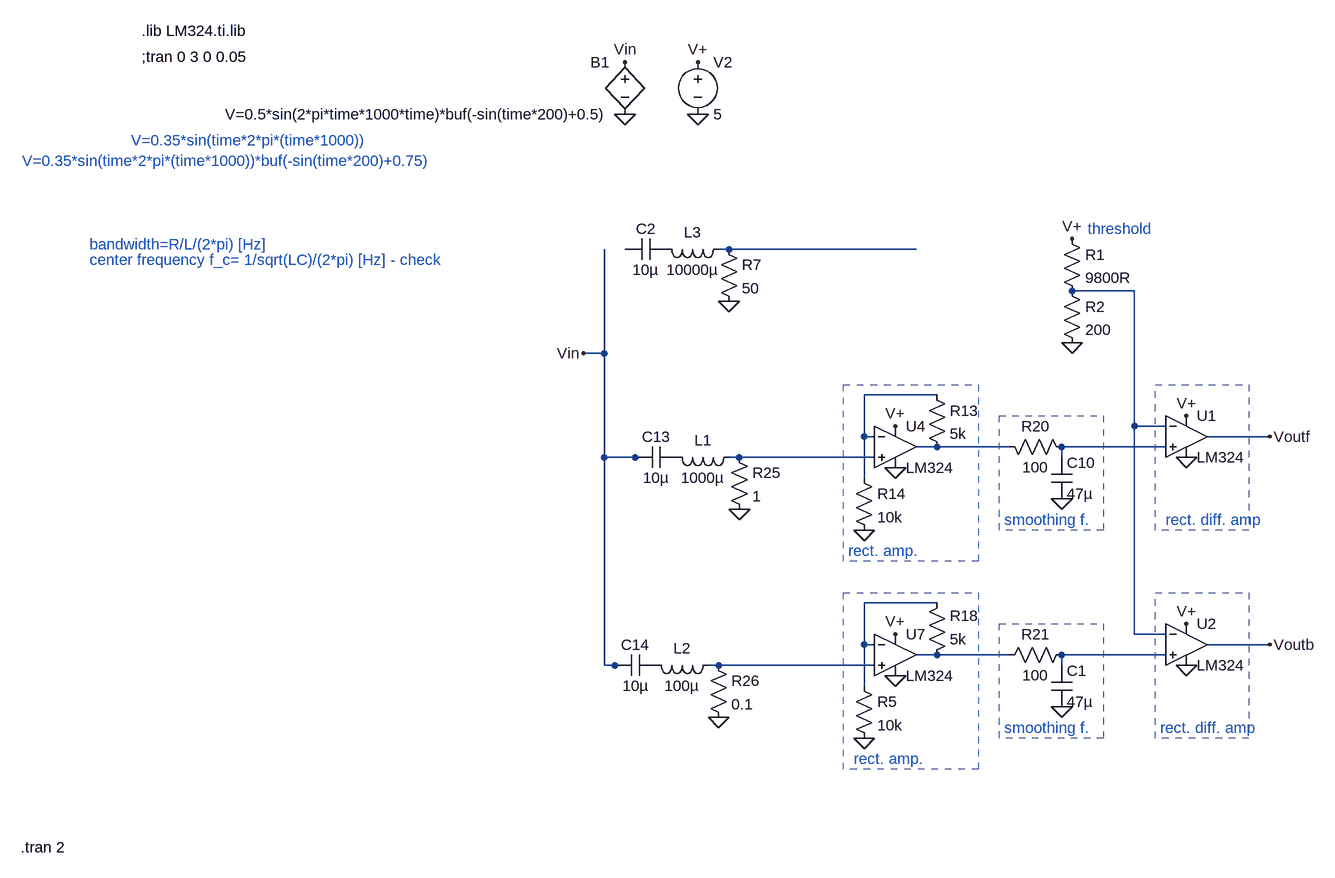
[diagram p0: schematic circuit-rlc-thresh.asc]
circuit-rlc-thresh.asc, the LTspice schematic file:
Version 4
SHEET 1 1988 1492
WIRE -320 64 -336 64
WIRE -176 64 -192 64
WIRE 112 64 -176 64
WIRE 448 128 352 128
WIRE -368 224 -368 64
WIRE -368 224 -400 224
WIRE 144 288 32 288
WIRE 448 336 448 128
WIRE 496 336 448 336
WIRE 32 352 32 288
WIRE 48 352 32 352
WIRE 656 352 560 352
WIRE 144 368 112 368
WIRE 256 368 144 368
WIRE 496 368 336 368
WIRE -368 384 -368 224
WIRE -320 384 -368 384
WIRE -304 384 -320 384
WIRE -160 384 -176 384
WIRE 48 384 -160 384
WIRE 336 384 336 368
WIRE 32 416 32 352
WIRE 144 608 32 608
WIRE 448 656 448 336
WIRE 496 656 448 656
WIRE 32 672 32 608
WIRE 48 672 32 672
WIRE 656 672 560 672
WIRE 144 688 112 688
WIRE 256 688 144 688
WIRE 496 688 336 688
WIRE -368 704 -368 384
WIRE -352 704 -368 704
WIRE -336 704 -352 704
WIRE -192 704 -208 704
WIRE 48 704 -192 704
WIRE 336 704 336 688
WIRE 32 736 32 672
FLAG -336 -144 0
FLAG -224 -144 0
FLAG -224 -224 V+
FLAG 80 400 0
FLAG 32 496 0
FLAG 80 336 V+
FLAG 80 720 0
FLAG 32 816 0
FLAG 80 656 V+
FLAG 336 448 0
FLAG 336 768 0
FLAG 528 384 0
FLAG 528 320 V+
FLAG 656 352 Voutf
FLAG 528 704 0
FLAG 528 640 V+
FLAG 656 672 Voutb
FLAG -336 -224 Vin
FLAG -400 224 Vin
FLAG -160 464 0
FLAG -192 784 0
FLAG -176 144 0
FLAG 352 208 0
FLAG 352 48 V+
SYMBOL voltage -224 -240 R0
WINDOW 123 0 0 Left 2
WINDOW 39 0 0 Left 2
SYMATTR InstName V2
SYMATTR Value 5
SYMBOL bv -336 -240 M0
SYMATTR InstName B1
SYMATTR Value V=0.5*sin(2*pi*time*1000*time)*buf(-sin(time*200)+0.5)
SYMBOL Opamps\\opamp2 80 304 R0
SYMATTR InstName U4
SYMATTR Value LM324
SYMBOL res 128 272 R0
SYMATTR InstName R13
SYMATTR Value 5k
SYMBOL res 16 400 R0
SYMATTR InstName R14
SYMATTR Value 10k
SYMBOL Opamps\\opamp2 80 624 R0
SYMATTR InstName U7
SYMATTR Value LM324
SYMBOL res 128 704 M180
WINDOW 0 36 76 Left 2
WINDOW 3 36 40 Left 2
SYMATTR InstName R18
SYMATTR Value 5k
SYMBOL res 352 384 M270
WINDOW 0 32 56 VTop 2
WINDOW 3 0 56 VBottom 2
SYMATTR InstName R20
SYMATTR Value 100
SYMBOL cap 320 448 M180
WINDOW 0 24 56 Left 2
WINDOW 3 24 8 Left 2
SYMATTR InstName C10
SYMATTR Value 47µ
SYMBOL res 352 672 R90
WINDOW 0 0 56 VBottom 2
WINDOW 3 32 56 VTop 2
SYMATTR InstName R21
SYMATTR Value 100
SYMBOL res 16 720 R0
SYMATTR InstName R5
SYMATTR Value 10k
SYMBOL Opamps\\opamp2 528 288 R0
SYMATTR InstName U1
SYMATTR Value LM324
SYMBOL Opamps\\opamp2 528 608 R0
SYMATTR InstName U2
SYMATTR Value LM324
SYMBOL cap 320 704 R0
SYMATTR InstName C1
SYMATTR Value 47µ
SYMBOL cap -256 368 R90
WINDOW 0 0 32 VBottom 2
WINDOW 3 32 32 VTop 2
SYMATTR InstName C13
SYMATTR Value 10µ
SYMBOL ind -160 368 R90
WINDOW 0 5 56 VBottom 2
WINDOW 3 32 56 VTop 2
SYMATTR InstName L1
SYMATTR Value 1000µ
SYMBOL res -176 368 R0
SYMATTR InstName R25
SYMATTR Value 1
SYMBOL cap -288 688 R90
WINDOW 0 0 32 VBottom 2
WINDOW 3 32 32 VTop 2
SYMATTR InstName C14
SYMATTR Value 10µ
SYMBOL ind -192 688 R90
WINDOW 0 5 56 VBottom 2
WINDOW 3 32 56 VTop 2
SYMATTR InstName L2
SYMATTR Value 100µ
SYMBOL res -208 688 R0
SYMATTR InstName R26
SYMATTR Value 0.1
SYMBOL cap -272 48 R90
WINDOW 0 0 32 VBottom 2
WINDOW 3 32 32 VTop 2
SYMATTR InstName C2
SYMATTR Value 10µ
SYMBOL ind -176 48 R90
WINDOW 0 5 56 VBottom 2
WINDOW 3 32 56 VTop 2
SYMATTR InstName L3
SYMATTR Value 10000µ
SYMBOL res -192 48 R0
SYMATTR InstName R7
SYMATTR Value 50
SYMBOL res 336 32 R0
SYMATTR InstName R1
SYMATTR Value 9800R
SYMBOL res 336 112 R0
SYMATTR InstName R2
SYMATTR Value 200
TEXT -1080 -272 Left 2 !.lib LM324.ti.lib
TEXT -1080 -232 Left 2 !;tran 0 3 0 0.05
TEXT -1096 -104 Left 2 ;V=0.35*sin(time*2*pi*(time*1000))
TEXT -1264 -72 Left 2 ;V=0.35*sin(time*2*pi*(time*1000))*buf(-sin(time*200)+0.75)
TEXT 8 528 Left 2 ;rect. amp.
TEXT 16 848 Left 2 ;rect. amp.
TEXT 248 480 Left 2 ;smoothing f.
TEXT 248 800 Left 2 ;smoothing f.
TEXT 496 480 Left 2 ;rect. diff. amp
TEXT 488 800 Left 2 ;rect. diff. amp
TEXT -1160 56 Left 2 ;bandwidth=R/L/(2*pi) [Hz]
TEXT -1160 80 Left 2 ;center frequency f_c= 1/sqrt(LC)/(2*pi) [Hz] - check
TEXT 376 32 Left 2 ;threshold
TEXT -1266 984 Left 2 !.tran 2
LINE Normal 0 544 0 272 2
LINE Normal 208 544 0 544 2
LINE Normal 208 272 208 544 2
LINE Normal 0 272 208 272 2
LINE Normal 0 864 0 592 2
LINE Normal 208 864 0 864 2
LINE Normal 208 592 208 864 2
LINE Normal 0 592 208 592 2
LINE Normal 240 496 240 320 2
LINE Normal 400 496 240 496 2
LINE Normal 400 320 400 496 2
LINE Normal 240 320 400 320 2
LINE Normal 240 816 240 640 2
LINE Normal 400 816 240 816 2
LINE Normal 400 640 400 816 2
LINE Normal 240 640 400 640 2
LINE Normal 480 496 480 272 2
LINE Normal 624 496 480 496 2
LINE Normal 624 272 624 496 2
LINE Normal 480 272 624 272 2
LINE Normal 480 816 480 592 2
LINE Normal 624 816 480 816 2
LINE Normal 624 592 624 816 2
LINE Normal 480 592 624 592 2

The netlist it stands for:
* circuit-rlc-thresh.asc
V2 V+ 0 5
B1 Vin 0 V=0.5*sin(2*pi*time*1000*time)*buf(-sin(time*200)+0.5)
XU4 N007 N004 V+ 0 N005 LM324  ; pins In+ In- V+ V- OUT
R13 N004 N005 5k
R14 N004 0 10k
XU7 N011 N008 V+ 0 N009 LM324  ; pins In+ In- V+ V- OUT
R18 N009 N008 5k
R20 N006 N005 100
C10 0 N006 47µ
R21 N010 N009 100
R5 N008 0 10k
XU1 N006 N003 V+ 0 Voutf LM324  ; pins In+ In- V+ V- OUT
XU2 N010 N003 V+ 0 Voutb LM324  ; pins In+ In- V+ V- OUT
C1 N010 0 47µ
C13 P001 Vin 10µ
L1 N007 P001 1000µ
R25 N007 0 1
C14 P002 Vin 10µ
L2 N011 P002 100µ
R26 N011 0 0.1
C2 P003 N001 10µ
L3 N002 P003 10000µ
R7 N002 0 50
R1 V+ N003 9800R
R2 N003 0 200
.lib LM324.ti.lib
;tran 0 3 0 0.05
* V=0.35*sin(time*2*pi*(time*1000))
* V=0.35*sin(time*2*pi*(time*1000))*buf(-sin(time*200)+0.75)
* rect. amp.
* rect. amp.
* smoothing f.
* smoothing f.
* rect. diff. amp
* rect. diff. amp
* bandwidth=R/L/(2*pi) [Hz]
* center frequency f_c= 1/sqrt(LC)/(2*pi) [Hz] - check
* threshold
.tran 2
.backanno
.end